# Altium schematic sheet RTU_LMG_RTC.SchDoc
size A4; SheetNumber: 9; SheetTotal: 16
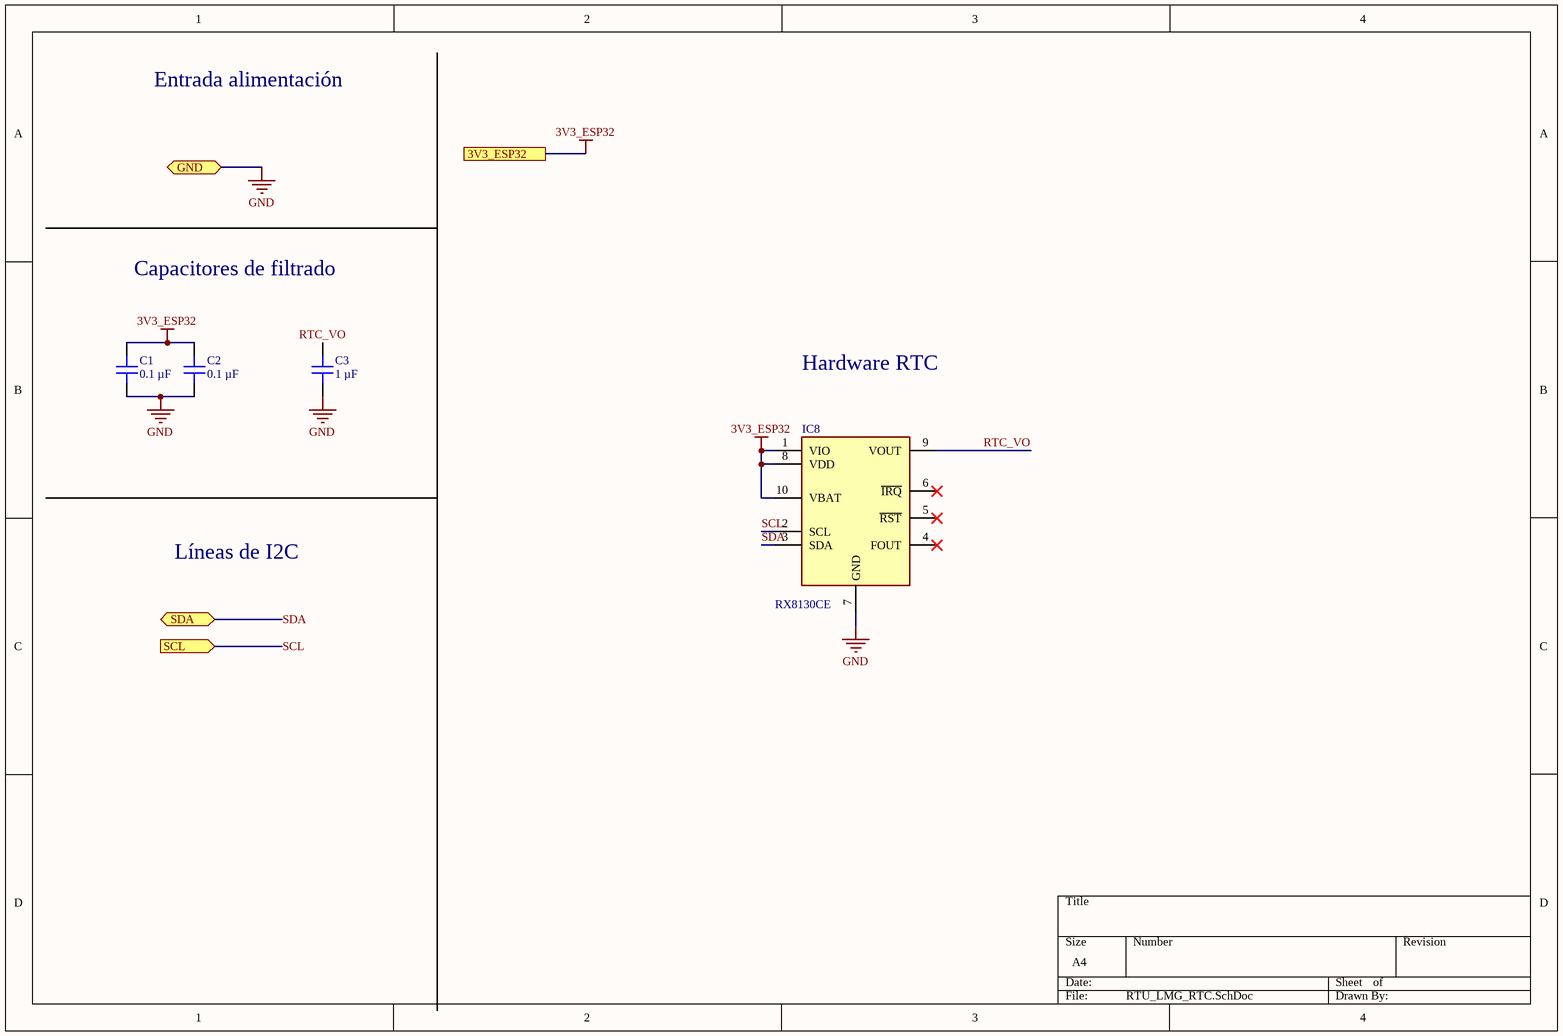
[diagram p0: RTU_LMG_RTC.SchDoc]

## Parts
C1  0.1 µF  [MURATA GRM155 0402_1005]
C2  0.1 µF  [MURATA GRM155 0402_1005]
C3  1 µF  [CAP 0402_1005]
IC8  RX8130CE  [RX8130CE]

## Ports
3V3_ESP32, GND (bidir), SCL (in), SDA (bidir)

## Nets
3V3_ESP32: C1.1 C2.1 IC8.1(VIO) IC8.8(VDD) IC8.10(VBAT) ; port 3V3_ESP32
GND: C1.2 C2.2 C3.2 IC8.7(GND) ; port GND
RTC_VO: C3.1 IC8.9(VOUT)
SCL: IC8.2(SCL) ; port SCL
SDA: IC8.3(SDA) ; port SDA

Not connected (* = marked no-connect by the designer): IC8 4(FOUT)* 5(~{RST})* 6(~{IRQ})*

## Notes on the sheet
- Entrada alimentación
- Capacitores de filtrado
- Hardware RTC
- Líneas de I2C

## Library data of the parts
C1 C2 = GRM155R71H104KE14D: CAP CER 0.1UF 50V X7R 0402; manufacturer: Murata Electronics; Tolerance: ±10%; Part Number: GRM155R71H104KE14D; Value: 0.1 µF; Applications: General Purpose; Capacitance: 0.1 µF; componentlink1description: Datasheet; componentlink1url: https://search.murata.co.jp/Ceramy/image/img/A01X/G101/ENG/GRM155R71H104KE14-01.pdf; componentlink2description: DigiKey Link; componentlink2url: https://www.digikey.com/en/products/detail/murata-electronics/GRM155R71H104KE14D/4906220; Device Package: 0402 (1005 Metric); lastupdated: 8/27/2024 12:42:53 PM; Lifecycle Status: Active; Minimum Order: 1; Mounting Type: Surface Mount, MLCC; Operating Temperature: -55°C ~ 125°C; Package / Case: 0402 (1005 Metric); packaging: TapeAndReel; partid: 12677; Part Status: Active; price: 0.01; series: GRM; Size / Dimension: 0.039" L x 0.020" W (1.00mm x 0.50mm); Supplier 1: DigiKey; Supplier Part Number 1: 490-10700-1-ND; Temperature Coefficient: X7R; Thickness (Max): 0.022" (0.55mm); Voltage - Rated: 50V
C3 = CL05A105KO5NNNC: CAP CER 1UF 16V X5R 0402; manufacturer: Samsung Electro-Mechanics; Tolerance: ±10%; Part Number: CL05A105KO5NNNC; Value: 1 µF; Applications: General Purpose; Capacitance: 1 µF; componentlink1description: Datasheet; componentlink1url: http://www.samsungsem.com/kr/support/product-search/mlcc/CL05A105KO5NNNC.jsp; componentlink2description: DigiKey Link; componentlink2url: https://www.digikey.com/en/products/detail/samsung-electro-mechanics/CL05A105KO5NNNC/3886725; Device Package: 0402 (1005 Metric); lastupdated: 2/9/2024 8:04:35 PM; Lifecycle Status: Active; Minimum Order: 1; Mounting Type: Surface Mount, MLCC; Operating Temperature: -55°C ~ 85°C; Package / Case: 0402 (1005 Metric); packaging: TapeAndReel; partid: 3120; Part Status: Active; price: 0.01; series: CL; Size / Dimension: 0.039" L x 0.020" W (1.00mm x 0.50mm); Supplier 1: DigiKey; Supplier Part Number 1: 1276-1067-1-ND; Temperature Coefficient: X5R; Thickness (Max): 0.022" (0.55mm); Voltage - Rated: 16V
IC8 = RX8130CE: IC RTC CLK/CALENDAR I2C 10SMD; Manufacturer_Name: Epson Timing; Datasheet Link: https://www.mouser.in/Search/DownloadDatasheet?url=https%3A%2F%2Fwww.mouser.in%2Fdatasheet%2F2%2F137%2FRX8130CE_en-1825324.pdf; Height: 1mm; Manufacturer_Part_Number: RX8130CE; Arrow Part Number: RX8130CE; Arrow Price/Stock: https://www.arrow.com/en/products/rx8130ce/epson-electronics-america